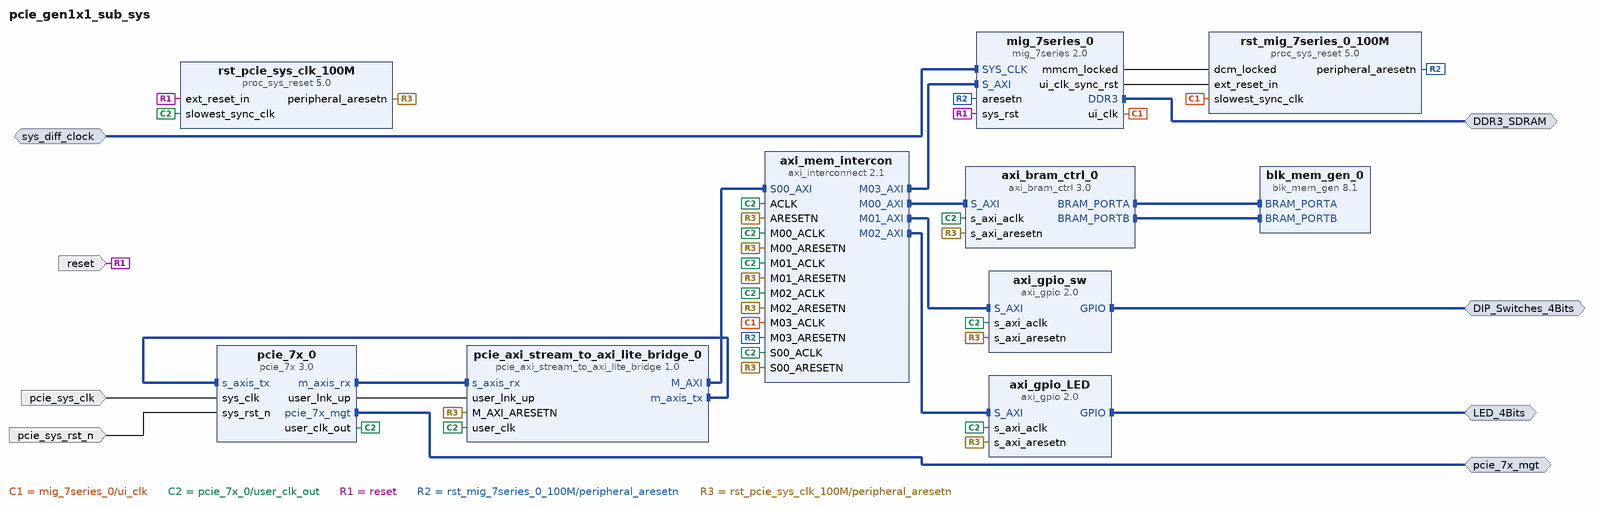
[diagram p0: block diagram of the top level]
# Vivado block design pcie_gen1x1_sub_sys, Vivado 2013.4
create_bd_design pcie_gen1x1_sub_sys

create_bd_intf_port -mode Master -vlnv xilinx.com:interface:ddrx_rtl:1.0 DDR3_SDRAM
create_bd_intf_port -mode Master -vlnv xilinx.com:interface:gpio_rtl:1.0 DIP_Switches_4Bits
create_bd_intf_port -mode Master -vlnv xilinx.com:interface:gpio_rtl:1.0 LED_4Bits
create_bd_intf_port -mode Master -vlnv xilinx.com:interface:pcie_7x_mgt_rtl:1.0 pcie_7x_mgt
create_bd_intf_port -mode Slave -vlnv xilinx.com:interface:diff_clock_rtl:1.0 sys_diff_clock
create_bd_port -dir I -type clk pcie_sys_clk
create_bd_port -dir I -type rst pcie_sys_rst_n
create_bd_port -dir I -type rst reset
set_property -dict {CONFIG.POLARITY ACTIVE_HIGH} [get_bd_ports reset]

create_bd_cell -type ip -vlnv xilinx.com:ip:axi_bram_ctrl:3.0 axi_bram_ctrl_0
create_bd_cell -type ip -vlnv xilinx.com:ip:axi_gpio:2.0 axi_gpio_LED
set_property -dict {CONFIG.USE_BOARD_FLOW true CONFIG.GPIO_BOARD_INTERFACE LED_4Bits} [get_bd_cells axi_gpio_LED]
create_bd_cell -type ip -vlnv xilinx.com:ip:axi_gpio:2.0 axi_gpio_sw
set_property -dict {CONFIG.USE_BOARD_FLOW true CONFIG.GPIO_BOARD_INTERFACE DIP_Switches_4Bits} [get_bd_cells axi_gpio_sw]
create_bd_cell -type ip -vlnv xilinx.com:ip:axi_interconnect:2.1 axi_mem_intercon
set_property -dict {CONFIG.NUM_MI 4} [get_bd_cells axi_mem_intercon]
create_bd_cell -type ip -vlnv xilinx.com:ip:blk_mem_gen:8.1 blk_mem_gen_0
set_property -dict {CONFIG.Memory_Type True_Dual_Port_RAM} [get_bd_cells blk_mem_gen_0]
create_bd_cell -type ip -vlnv xilinx.com:ip:mig_7series:2.0 mig_7series_0
set_property -dict [list \
  CONFIG.XML_INPUT_FILE mig_a.prj \
  CONFIG.RESET_BOARD_INTERFACE reset \
  CONFIG.MIG_DONT_TOUCH_PARAM Custom \
] [get_bd_cells mig_7series_0]
create_bd_cell -type ip -vlnv xilinx.com:ip:pcie_7x:3.0 pcie_7x_0
set_property -dict [list \
  CONFIG.mode_selection Advanced \
  CONFIG.Bar0_Scale Kilobytes \
  CONFIG.Bar0_Size 32 \
  CONFIG.Bar1_Enabled true \
  CONFIG.Bar1_Size 64 \
  CONFIG.Bar2_Enabled true \
  CONFIG.Bar2_Size 64 \
  CONFIG.Bar3_Enabled true \
  CONFIG.Bar3_Scale Gigabytes \
  CONFIG.Bar3_Size 1 \
  CONFIG.PCIe_Debug_Ports false \
  CONFIG.en_ext_clk false \
  CONFIG.pl_interface false \
  CONFIG.cfg_mgmt_if false \
  CONFIG.cfg_ctl_if false \
  CONFIG.cfg_status_if false \
  CONFIG.rcv_msg_if false \
  CONFIG.cfg_fc_if false \
  CONFIG.err_reporting_if false \
] [get_bd_cells pcie_7x_0]
create_bd_cell -type ip -vlnv sanjayr:user:pcie_axi_stream_to_axi_lite_bridge:1.0 pcie_axi_stream_to_axi_lite_bridge_0
set_property -dict [list \
  CONFIG.AXI_BAR_3_MASK 0xC0000000 \
  CONFIG.AXI_BAR_3_ADDR 0x80000000 \
  CONFIG.AXI_BAR_2_MASK 0xFFFF0000 \
  CONFIG.AXI_BAR_2_ADDR 0x40010000 \
  CONFIG.AXI_BAR_1_MASK 0xFFFF0000 \
  CONFIG.AXI_BAR_1_ADDR 0x40000000 \
  CONFIG.AXI_BAR_0_MASK 0xFFFF8000 \
  CONFIG.AXI_BAR_0_ADDR 0x20000000 \
  CONFIG.C_DATA_WIDTH 64 \
] [get_bd_cells pcie_axi_stream_to_axi_lite_bridge_0]
create_bd_cell -type ip -vlnv xilinx.com:ip:proc_sys_reset:5.0 rst_mig_7series_0_100M
create_bd_cell -type ip -vlnv xilinx.com:ip:proc_sys_reset:5.0 rst_pcie_sys_clk_100M
set_property -dict {CONFIG.USE_BOARD_FLOW true CONFIG.RESET_BOARD_INTERFACE reset} [get_bd_cells rst_pcie_sys_clk_100M]

# ---- connections ----

connect_bd_intf_net [get_bd_intf_pins axi_bram_ctrl_0/BRAM_PORTA] [get_bd_intf_pins blk_mem_gen_0/BRAM_PORTA]
connect_bd_intf_net [get_bd_intf_pins axi_bram_ctrl_0/BRAM_PORTB] [get_bd_intf_pins blk_mem_gen_0/BRAM_PORTB]
connect_bd_intf_net [get_bd_intf_pins axi_bram_ctrl_0/S_AXI] [get_bd_intf_pins axi_mem_intercon/M00_AXI]
connect_bd_intf_net [get_bd_intf_pins axi_gpio_sw/S_AXI] [get_bd_intf_pins axi_mem_intercon/M01_AXI]
connect_bd_intf_net [get_bd_intf_pins axi_gpio_LED/S_AXI] [get_bd_intf_pins axi_mem_intercon/M02_AXI]
connect_bd_intf_net [get_bd_intf_pins axi_mem_intercon/M03_AXI] [get_bd_intf_pins mig_7series_0/S_AXI]
connect_bd_intf_net [get_bd_intf_pins pcie_7x_0/m_axis_rx] [get_bd_intf_pins pcie_axi_stream_to_axi_lite_bridge_0/s_axis_rx]
connect_bd_intf_net [get_bd_intf_pins axi_mem_intercon/S00_AXI] [get_bd_intf_pins pcie_axi_stream_to_axi_lite_bridge_0/M_AXI]
connect_bd_intf_net [get_bd_intf_pins pcie_7x_0/s_axis_tx] [get_bd_intf_pins pcie_axi_stream_to_axi_lite_bridge_0/m_axis_tx]
connect_bd_intf_net [get_bd_intf_ports DDR3_SDRAM] [get_bd_intf_pins mig_7series_0/DDR3]
connect_bd_intf_net [get_bd_intf_ports DIP_Switches_4Bits] [get_bd_intf_pins axi_gpio_sw/GPIO]
connect_bd_intf_net [get_bd_intf_ports LED_4Bits] [get_bd_intf_pins axi_gpio_LED/GPIO]
connect_bd_intf_net [get_bd_intf_ports pcie_7x_mgt] [get_bd_intf_pins pcie_7x_0/pcie_7x_mgt]
connect_bd_intf_net [get_bd_intf_ports sys_diff_clock] [get_bd_intf_pins mig_7series_0/SYS_CLK]
connect_bd_net [get_bd_pins mig_7series_0/mmcm_locked] [get_bd_pins rst_mig_7series_0_100M/dcm_locked]
connect_bd_net [get_bd_pins mig_7series_0/ui_clk] [get_bd_pins axi_mem_intercon/M03_ACLK] [get_bd_pins rst_mig_7series_0_100M/slowest_sync_clk]
connect_bd_net [get_bd_pins mig_7series_0/ui_clk_sync_rst] [get_bd_pins rst_mig_7series_0_100M/ext_reset_in]
connect_bd_net [get_bd_pins pcie_7x_0/user_clk_out] \
  [get_bd_pins axi_bram_ctrl_0/s_axi_aclk] [get_bd_pins axi_gpio_LED/s_axi_aclk] [get_bd_pins axi_gpio_sw/s_axi_aclk] \
  [get_bd_pins axi_mem_intercon/ACLK] [get_bd_pins axi_mem_intercon/M00_ACLK] [get_bd_pins axi_mem_intercon/M01_ACLK] \
  [get_bd_pins axi_mem_intercon/M02_ACLK] [get_bd_pins axi_mem_intercon/S00_ACLK] \
  [get_bd_pins pcie_axi_stream_to_axi_lite_bridge_0/user_clk] [get_bd_pins rst_pcie_sys_clk_100M/slowest_sync_clk]
connect_bd_net [get_bd_pins pcie_7x_0/user_lnk_up] [get_bd_pins pcie_axi_stream_to_axi_lite_bridge_0/user_lnk_up]
connect_bd_net [get_bd_ports pcie_sys_clk] [get_bd_pins pcie_7x_0/sys_clk]
connect_bd_net [get_bd_ports reset] [get_bd_pins mig_7series_0/sys_rst] [get_bd_pins rst_pcie_sys_clk_100M/ext_reset_in]
connect_bd_net [get_bd_pins rst_mig_7series_0_100M/peripheral_aresetn] [get_bd_pins axi_mem_intercon/M03_ARESETN] [get_bd_pins mig_7series_0/aresetn]
connect_bd_net [get_bd_pins rst_pcie_sys_clk_100M/peripheral_aresetn] \
  [get_bd_pins axi_bram_ctrl_0/s_axi_aresetn] [get_bd_pins axi_gpio_LED/s_axi_aresetn] \
  [get_bd_pins axi_gpio_sw/s_axi_aresetn] [get_bd_pins axi_mem_intercon/ARESETN] [get_bd_pins axi_mem_intercon/M00_ARESETN] \
  [get_bd_pins axi_mem_intercon/M01_ARESETN] [get_bd_pins axi_mem_intercon/M02_ARESETN] \
  [get_bd_pins axi_mem_intercon/S00_ARESETN] [get_bd_pins pcie_axi_stream_to_axi_lite_bridge_0/M_AXI_ARESETN]
connect_bd_net -net sys_rst_n_1 [get_bd_ports pcie_sys_rst_n] [get_bd_pins pcie_7x_0/sys_rst_n]

# ---- address map ----
assign_bd_address -offset 0x20000000 -range 32K -target_address_space [get_bd_addr_spaces pcie_axi_stream_to_axi_lite_bridge_0/M_AXI] [get_bd_addr_segs axi_bram_ctrl_0/S_AXI/Mem0]
assign_bd_address -offset 0x40000000 -range 64K -target_address_space [get_bd_addr_spaces pcie_axi_stream_to_axi_lite_bridge_0/M_AXI] [get_bd_addr_segs axi_gpio_sw/S_AXI/Reg]
assign_bd_address -offset 0x40010000 -range 64K -target_address_space [get_bd_addr_spaces pcie_axi_stream_to_axi_lite_bridge_0/M_AXI] [get_bd_addr_segs axi_gpio_LED/S_AXI/Reg]
assign_bd_address -offset 0x80000000 -range 1G -target_address_space [get_bd_addr_spaces pcie_axi_stream_to_axi_lite_bridge_0/M_AXI] [get_bd_addr_segs mig_7series_0/memmap/memaddr]

validate_bd_design
save_bd_design
